# Altium schematic sheet Scanners.SchDoc
size 508 x 254 mm
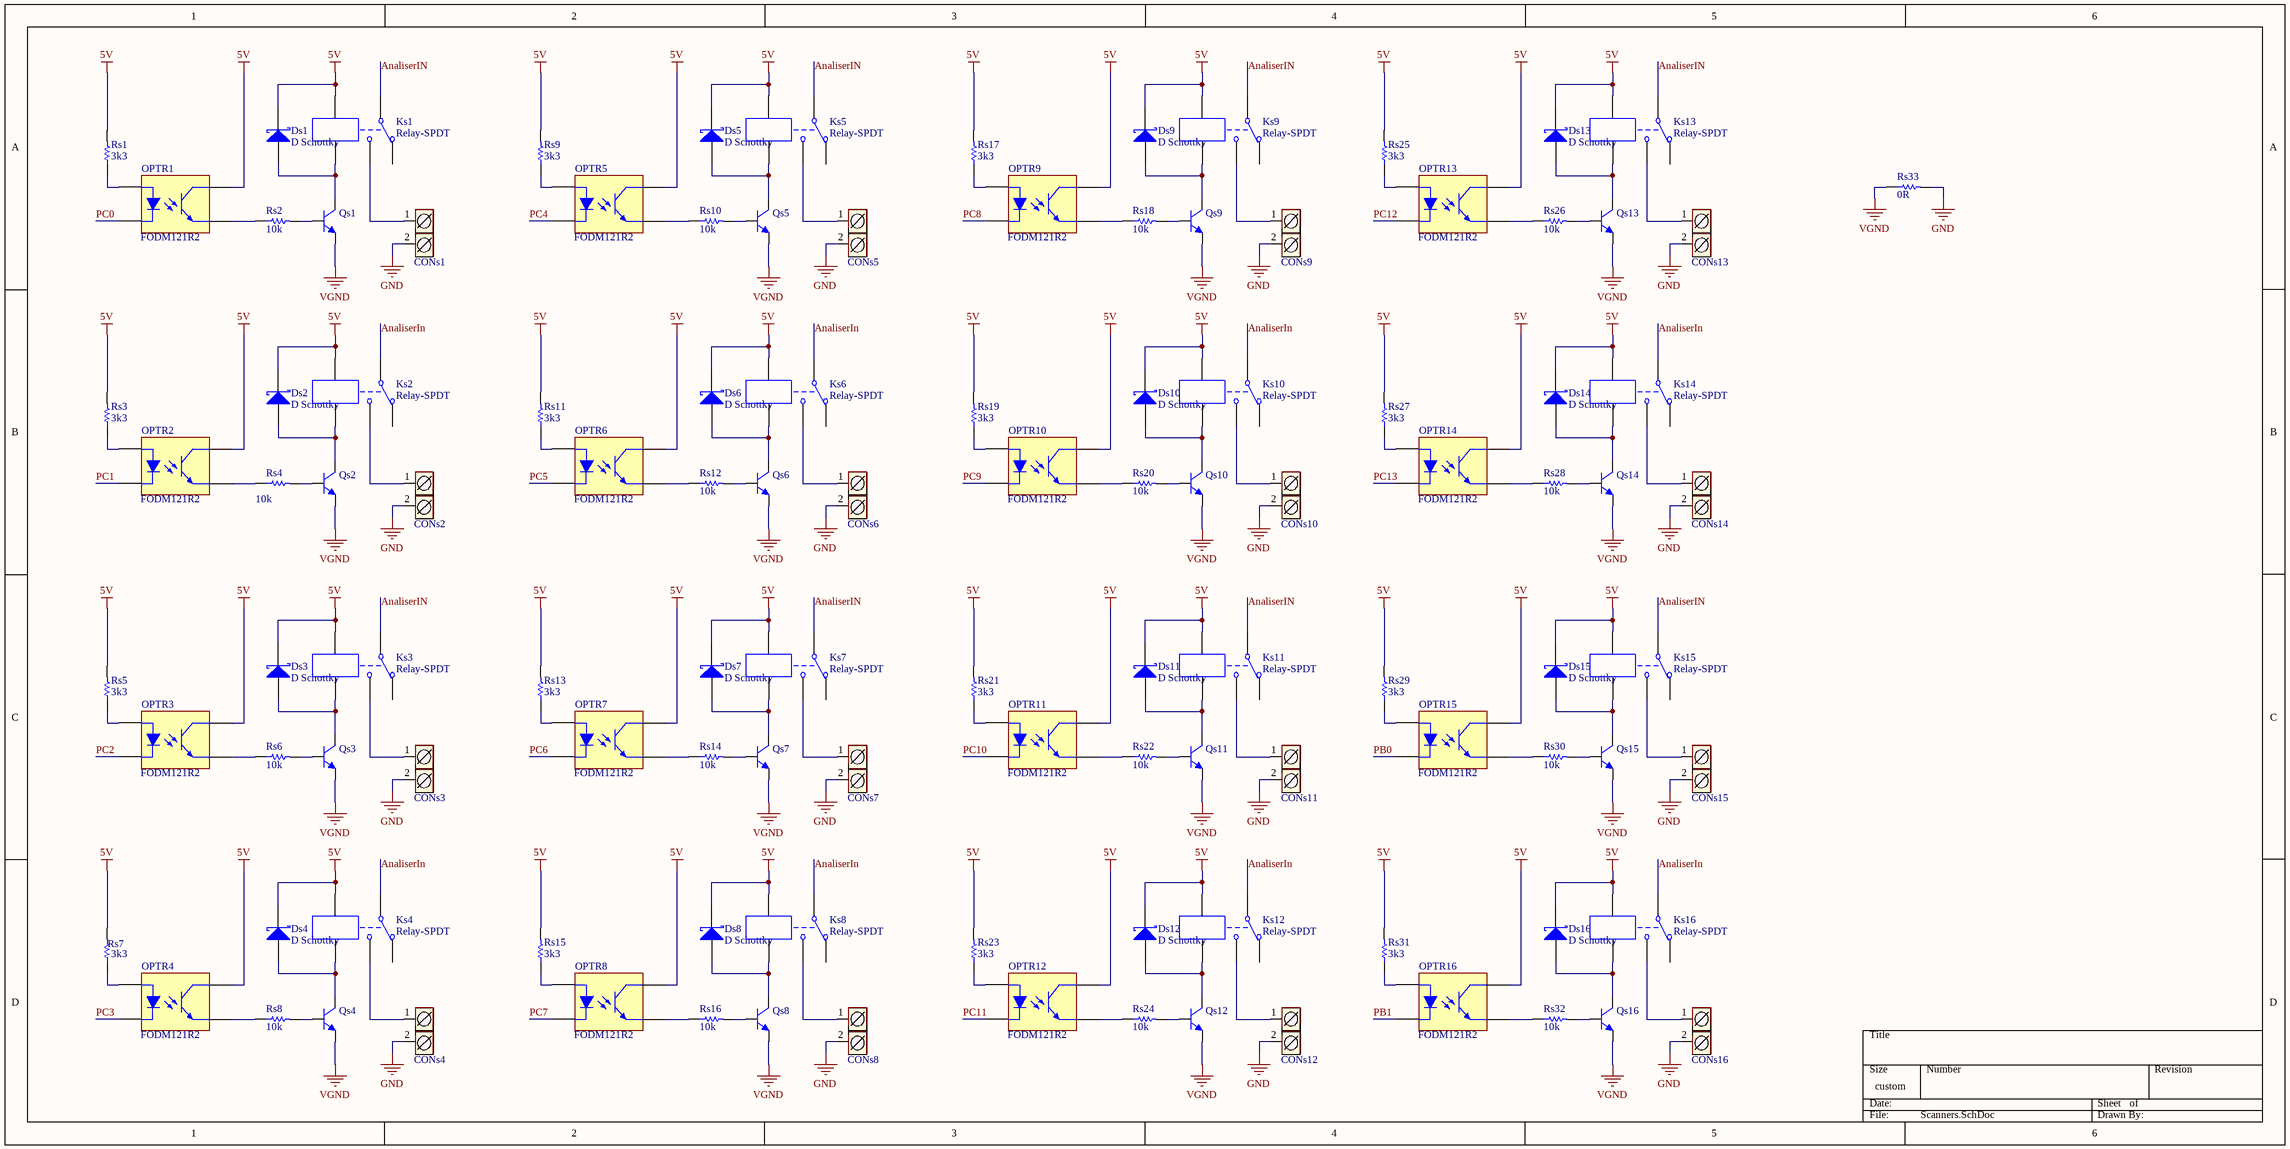
[diagram p0: Scanners.SchDoc]

## Parts
CONs1  ARK2  [ARK2]  (value not drawn)
CONs2  ARK2  [ARK2]  (value not drawn)
CONs3  ARK2  [ARK2]  (value not drawn)
CONs4  ARK2  [ARK2]  (value not drawn)
CONs5  ARK2  [ARK2]  (value not drawn)
CONs6  ARK2  [ARK2]  (value not drawn)
CONs7  ARK2  [ARK2]  (value not drawn)
CONs8  ARK2  [ARK2]  (value not drawn)
CONs9  ARK2  [ARK2]  (value not drawn)
CONs10  ARK2  [ARK2]  (value not drawn)
CONs11  ARK2  [ARK2]  (value not drawn)
CONs12  ARK2  [ARK2]  (value not drawn)
CONs13  ARK2  [ARK2]  (value not drawn)
CONs14  ARK2  [ARK2]  (value not drawn)
CONs15  ARK2  [ARK2]  (value not drawn)
CONs16  ARK2  [ARK2]  (value not drawn)
Ds1  D Schottky  [SMA]
Ds2  D Schottky  [SMA]
Ds3  D Schottky  [SMA]
Ds4  D Schottky  [SMA]
Ds5  D Schottky  [SMA]
Ds6  D Schottky  [SMA]
Ds7  D Schottky  [SMA]
Ds8  D Schottky  [SMA]
Ds9  D Schottky  [SMA]
Ds10  D Schottky  [SMA]
Ds11  D Schottky  [SMA]
Ds12  D Schottky  [SMA]
Ds13  D Schottky  [SMA]
Ds14  D Schottky  [SMA]
Ds15  D Schottky  [SMA]
Ds16  D Schottky  [SMA]
Ks1  Relay-SPDT  [Relay_m1]
Ks2  Relay-SPDT  [Relay_m1]
Ks3  Relay-SPDT  [Relay_m1]
Ks4  Relay-SPDT  [Relay_m1]
Ks5  Relay-SPDT  [Relay_m1]
Ks6  Relay-SPDT  [Relay_m1]
Ks7  Relay-SPDT  [Relay_m1]
Ks8  Relay-SPDT  [Relay_m1]
Ks9  Relay-SPDT  [Relay_m1]
Ks10  Relay-SPDT  [Relay_m1]
Ks11  Relay-SPDT  [Relay_m1]
Ks12  Relay-SPDT  [Relay_m1]
Ks13  Relay-SPDT  [Relay_m1]
Ks14  Relay-SPDT  [Relay_m1]
Ks15  Relay-SPDT  [Relay_m1]
Ks16  Relay-SPDT  [Relay_m1]
OPTR1  FODM121R2  [FAIR-MFP 4L_V]
OPTR2  FODM121R2  [FAIR-MFP 4L_V]
OPTR3  FODM121R2  [FAIR-MFP 4L_V]
OPTR4  FODM121R2  [FAIR-MFP 4L_V]
OPTR5  FODM121R2  [FAIR-MFP 4L_V]
OPTR6  FODM121R2  [FAIR-MFP 4L_V]
OPTR7  FODM121R2  [FAIR-MFP 4L_V]
OPTR8  FODM121R2  [FAIR-MFP 4L_V]
OPTR9  FODM121R2  [FAIR-MFP 4L_V]
OPTR10  FODM121R2  [FAIR-MFP 4L_V]
OPTR11  FODM121R2  [FAIR-MFP 4L_V]
OPTR12  FODM121R2  [FAIR-MFP 4L_V]
OPTR13  FODM121R2  [FAIR-MFP 4L_V]
OPTR14  FODM121R2  [FAIR-MFP 4L_V]
OPTR15  FODM121R2  [FAIR-MFP 4L_V]
OPTR16  FODM121R2  [FAIR-MFP 4L_V]
Qs1  BC817-25  [SOT23_N]  (value not drawn)
Qs2  BC817-25  [SOT23_N]  (value not drawn)
Qs3  BC817-25  [SOT23_N]  (value not drawn)
Qs4  BC817-25  [SOT23_N]  (value not drawn)
Qs5  BC817-25  [SOT23_N]  (value not drawn)
Qs6  BC817-25  [SOT23_N]  (value not drawn)
Qs7  BC817-25  [SOT23_N]  (value not drawn)
Qs8  BC817-25  [SOT23_N]  (value not drawn)
Qs9  BC817-25  [SOT23_N]  (value not drawn)
Qs10  BC817-25  [SOT23_N]  (value not drawn)
Qs11  BC817-25  [SOT23_N]  (value not drawn)
Qs12  BC817-25  [SOT23_N]  (value not drawn)
Qs13  BC817-25  [SOT23_N]  (value not drawn)
Qs14  BC817-25  [SOT23_N]  (value not drawn)
Qs15  BC817-25  [SOT23_N]  (value not drawn)
Qs16  BC817-25  [SOT23_N]  (value not drawn)
Rs1  3k3  [RESC0603(1608)_L]
Rs2  10k  [RESC0603(1608)_L]
Rs3  3k3  [RESC0603(1608)_L]
Rs4  10k  [RESC0603(1608)_L]
Rs5  3k3  [RESC0603(1608)_L]
Rs6  10k  [RESC0603(1608)_L]
Rs7  3k3  [RESC0603(1608)_L]
Rs8  10k  [RESC0603(1608)_L]
Rs9  3k3  [RESC0603(1608)_L]
Rs10  10k  [RESC0603(1608)_L]
Rs11  3k3  [RESC0603(1608)_L]
Rs12  10k  [RESC0603(1608)_L]
Rs13  3k3  [RESC0603(1608)_L]
Rs14  10k  [RESC0603(1608)_L]
Rs15  3k3  [RESC0603(1608)_L]
Rs16  10k  [RESC0603(1608)_L]
Rs17  3k3  [RESC0603(1608)_L]
Rs18  10k  [RESC0603(1608)_L]
Rs19  3k3  [RESC0603(1608)_L]
Rs20  10k  [RESC0603(1608)_L]
Rs21  3k3  [RESC0603(1608)_L]
Rs22  10k  [RESC0603(1608)_L]
Rs23  3k3  [RESC0603(1608)_L]
Rs24  10k  [RESC0603(1608)_L]
Rs25  3k3  [RESC0603(1608)_L]
Rs26  10k  [RESC0603(1608)_L]
Rs27  3k3  [RESC0603(1608)_L]
Rs28  10k  [RESC0603(1608)_L]
Rs29  3k3  [RESC0603(1608)_L]
Rs30  10k  [RESC0603(1608)_L]
Rs31  3k3  [RESC0603(1608)_L]
Rs32  10k  [RESC0603(1608)_L]
Rs33  0R  [RESC0603(1608)_L]

## Nets
5V: Ds1.2(K) Ds2.2(K) Ds3.2(K) Ds4.2(K) Ds5.2(K) Ds6.2(K) Ds7.2(K) Ds8.2(K) Ds9.2(K) Ds10.2(K) Ds11.2(K) Ds12.2(K) Ds13.2(K) Ds14.2(K) Ds15.2(K) Ds16.2(K) Ks1.4 Ks2.4 Ks3.4 Ks4.4 Ks5.4 Ks6.4 Ks7.4 Ks8.4 Ks9.4 Ks10.4 Ks11.4 Ks12.4 Ks13.4 Ks14.4 Ks15.4 Ks16.4 OPTR1.4(COLLECTOR) OPTR2.4(COLLECTOR) OPTR3.4(COLLECTOR) OPTR4.4(COLLECTOR) OPTR5.4(COLLECTOR) OPTR6.4(COLLECTOR) OPTR7.4(COLLECTOR) OPTR8.4(COLLECTOR) OPTR9.4(COLLECTOR) OPTR10.4(COLLECTOR) OPTR11.4(COLLECTOR) OPTR12.4(COLLECTOR) OPTR13.4(COLLECTOR) OPTR14.4(COLLECTOR) OPTR15.4(COLLECTOR) OPTR16.4(COLLECTOR) Rs1.2 Rs3.2 Rs5.2 Rs7.2 Rs9.2 Rs11.2 Rs13.2 Rs15.2 Rs17.2 Rs19.2 Rs21.2 Rs23.2 Rs25.2 Rs27.2 Rs29.2 Rs31.2
GND: CONs1.2 CONs2.2 CONs3.2 CONs4.2 CONs5.2 CONs6.2 CONs7.2 CONs8.2 CONs9.2 CONs10.2 CONs11.2 CONs12.2 CONs13.2 CONs14.2 CONs15.2 CONs16.2 Rs33.2
VGND: Qs1.2(E) Qs2.2(E) Qs3.2(E) Qs4.2(E) Qs5.2(E) Qs6.2(E) Qs7.2(E) Qs8.2(E) Qs9.2(E) Qs10.2(E) Qs11.2(E) Qs12.2(E) Qs13.2(E) Qs14.2(E) Qs15.2(E) Qs16.2(E) Rs33.1
AnaliserIN: Ks1.1 Ks2.1 Ks3.1 Ks4.1 Ks5.1 Ks6.1 Ks7.1 Ks8.1 Ks9.1 Ks10.1 Ks11.1 Ks12.1 Ks13.1 Ks14.1 Ks15.1 Ks16.1
PB0: OPTR15.2(CATHODE)
PB1: OPTR16.2(CATHODE)
PC0: OPTR1.2(CATHODE)
PC1: OPTR2.2(CATHODE)
PC2: OPTR3.2(CATHODE)
PC3: OPTR4.2(CATHODE)
PC4: OPTR5.2(CATHODE)
PC5: OPTR6.2(CATHODE)
PC6: OPTR7.2(CATHODE)
PC7: OPTR8.2(CATHODE)
PC8: OPTR9.2(CATHODE)
PC9: OPTR10.2(CATHODE)
PC10: OPTR11.2(CATHODE)
PC11: OPTR12.2(CATHODE)
PC12: OPTR13.2(CATHODE)
PC13: OPTR14.2(CATHODE)
NetCONs1_1: CONs1.1 Ks1.3
NetCONs2_1: CONs2.1 Ks2.3
NetCONs3_1: CONs3.1 Ks3.3
NetCONs4_1: CONs4.1 Ks4.3
NetCONs5_1: CONs5.1 Ks5.3
NetCONs6_1: CONs6.1 Ks6.3
NetCONs7_1: CONs7.1 Ks7.3
NetCONs8_1: CONs8.1 Ks8.3
NetCONs9_1: CONs9.1 Ks9.3
NetCONs10_1: CONs10.1 Ks10.3
NetCONs11_1: CONs11.1 Ks11.3
NetCONs12_1: CONs12.1 Ks12.3
NetCONs13_1: CONs13.1 Ks13.3
NetCONs14_1: CONs14.1 Ks14.3
NetCONs15_1: CONs15.1 Ks15.3
NetCONs16_1: CONs16.1 Ks16.3
NetDs1_1: Ds1.1(A) Ks1.5 Qs1.3(C)
NetDs2_1: Ds2.1(A) Ks2.5 Qs2.3(C)
NetDs3_1: Ds3.1(A) Ks3.5 Qs3.3(C)
NetDs4_1: Ds4.1(A) Ks4.5 Qs4.3(C)
NetDs5_1: Ds5.1(A) Ks5.5 Qs5.3(C)
NetDs6_1: Ds6.1(A) Ks6.5 Qs6.3(C)
NetDs7_1: Ds7.1(A) Ks7.5 Qs7.3(C)
NetDs8_1: Ds8.1(A) Ks8.5 Qs8.3(C)
NetDs9_1: Ds9.1(A) Ks9.5 Qs9.3(C)
NetDs10_1: Ds10.1(A) Ks10.5 Qs10.3(C)
NetDs11_1: Ds11.1(A) Ks11.5 Qs11.3(C)
NetDs12_1: Ds12.1(A) Ks12.5 Qs12.3(C)
NetDs13_1: Ds13.1(A) Ks13.5 Qs13.3(C)
NetDs14_1: Ds14.1(A) Ks14.5 Qs14.3(C)
NetDs15_1: Ds15.1(A) Ks15.5 Qs15.3(C)
NetDs16_1: Ds16.1(A) Ks16.5 Qs16.3(C)
NetOPTR1_1: OPTR1.1(ANODE) Rs1.1
NetOPTR1_3: OPTR1.3(EMITTER) Rs2.1
NetOPTR2_1: OPTR2.1(ANODE) Rs3.1
NetOPTR2_3: OPTR2.3(EMITTER) Rs4.1
NetOPTR3_1: OPTR3.1(ANODE) Rs5.1
NetOPTR3_3: OPTR3.3(EMITTER) Rs6.1
NetOPTR4_1: OPTR4.1(ANODE) Rs7.1
NetOPTR4_3: OPTR4.3(EMITTER) Rs8.1
NetOPTR5_1: OPTR5.1(ANODE) Rs9.1
NetOPTR5_3: OPTR5.3(EMITTER) Rs10.1
NetOPTR6_1: OPTR6.1(ANODE) Rs11.1
NetOPTR6_3: OPTR6.3(EMITTER) Rs12.1
NetOPTR7_1: OPTR7.1(ANODE) Rs13.1
NetOPTR7_3: OPTR7.3(EMITTER) Rs14.1
NetOPTR8_1: OPTR8.1(ANODE) Rs15.1
NetOPTR8_3: OPTR8.3(EMITTER) Rs16.1
NetOPTR9_1: OPTR9.1(ANODE) Rs17.1
NetOPTR9_3: OPTR9.3(EMITTER) Rs18.1
NetOPTR10_1: OPTR10.1(ANODE) Rs19.1
NetOPTR10_3: OPTR10.3(EMITTER) Rs20.1
NetOPTR11_1: OPTR11.1(ANODE) Rs21.1
NetOPTR11_3: OPTR11.3(EMITTER) Rs22.1
NetOPTR12_1: OPTR12.1(ANODE) Rs23.1
NetOPTR12_3: OPTR12.3(EMITTER) Rs24.1
NetOPTR13_1: OPTR13.1(ANODE) Rs25.1
NetOPTR13_3: OPTR13.3(EMITTER) Rs26.1
NetOPTR14_1: OPTR14.1(ANODE) Rs27.1
NetOPTR14_3: OPTR14.3(EMITTER) Rs28.1
NetOPTR15_1: OPTR15.1(ANODE) Rs29.1
NetOPTR15_3: OPTR15.3(EMITTER) Rs30.1
NetOPTR16_1: OPTR16.1(ANODE) Rs31.1
NetOPTR16_3: OPTR16.3(EMITTER) Rs32.1
NetQs1_1: Qs1.1(B) Rs2.2
NetQs2_1: Qs2.1(B) Rs4.2
NetQs3_1: Qs3.1(B) Rs6.2
NetQs4_1: Qs4.1(B) Rs8.2
NetQs5_1: Qs5.1(B) Rs10.2
NetQs6_1: Qs6.1(B) Rs12.2
NetQs7_1: Qs7.1(B) Rs14.2
NetQs8_1: Qs8.1(B) Rs16.2
NetQs9_1: Qs9.1(B) Rs18.2
NetQs10_1: Qs10.1(B) Rs20.2
NetQs11_1: Qs11.1(B) Rs22.2
NetQs12_1: Qs12.1(B) Rs24.2
NetQs13_1: Qs13.1(B) Rs26.2
NetQs14_1: Qs14.1(B) Rs28.2
NetQs15_1: Qs15.1(B) Rs30.2
NetQs16_1: Qs16.1(B) Rs32.2

Not connected (* = marked no-connect by the designer): Ks1 2; Ks2 2; Ks3 2; Ks4 2; Ks5 2; Ks6 2; Ks7 2; Ks8 2; Ks9 2; Ks10 2; Ks11 2; Ks12 2; Ks13 2; Ks14 2; Ks15 2; Ks16 2

## Library data of the parts
CONs1-CONs16 = ARK2: Złącze śrubowe 2 piny
Ds1-Ds16 = D Schottky: Schottky Diode; Published: 8-Jun-2000; LatestRevisionDate: 17-Jul-2002; LatestRevisionNote: Re-released for DXP Platform.; PackageReference: SMB; Publisher: Altium Limited; PackageDescription: DO-214-AA/SMB; 2 C-Bend Leads; Body 5.3 x 3.6 mm, inc. leads (LxW); Code_JEDEC: DO-214-AA
Ks1-Ks16 = Relay-SPDT: Single-Pole Dual-Throw Relay; Published: 24-Mar-1999; LatestRevisionDate: 17-Jul-2002; LatestRevisionNote: Re-released for DXP Platform.; PackageReference: MODULE5B; Publisher: Altium Limited
OPTR1-OPTR16 = CMP-1569-00003-1: Transistor Output Optocoupler, 1 to 1.3 V, -40 to 110 degC, 4-Pin SOP (MFP 4L), RoHS, Tape and Reel; VCE Saturation Max: 0.4 V; Forward Voltage Max: 1.3 V; Forward Voltage Min: 1 V; ComponentLink3URL: https://www.fairchildsemi.com/package-drawings/MF/MFP04C.pdf; Temperature Max: 110 degC; RoHS: TRUE; DatasheetVersion: Rev. 1.1.4; Temperature Min: -40 degC; Mounting Technology: Surface Mount; ComponentLink2Description: Datasheet; ComponentLink2URL: https://www.fairchildsemi.com/datasheets/FO/FODM121.pdf; ComponentLink1Description: Manufacturer URL; ComponentLink1URL: https://www.fairchildsemi.com/; ComponentLink3Description: Package Specification; PartNumber: FODM121; Packing: Tape and Reel; PackageDescription: 4-Pin Mini Flat Package, Body 3.85 x 4.4 mm, Pitch 2.54 mm
Qs1-Qs16 = BC817-25: NPN General-purpose Transistor; Published: 17-Sep-2003; LatestRevisionDate: 12-Dec-2006; LatestRevisionNote: IPC-7351 Footprint Added.; DatasheetVersion: Jun-1999; PackageVersion: May-1999; PackageReference: SOT23; Publisher: Altium Limited; PackageDescription: 3-Pin SOT-23 Package 0.95 mm Pitch, 2.3 mm Lead Span; ComponentLink1Description: Manufacturer Link; ComponentLink1URL: http://www.semiconductors.philips.com/; ComponentLink2Description: Datasheet; ComponentLink2URL: http://www.semiconductors.philips.com/acrobat/datasheets/BC817_BC817W_BC337_5.pdf
Rs1-Rs33 = CMP-1591-00001-1: 0603 (1608 Metric) Chip Resistor; Case-Metric: 1608; Case-EIA: 0603; PackageReference: RESC0603(1608)